# Altium schematic sheet StepStick.SchDoc
size A4
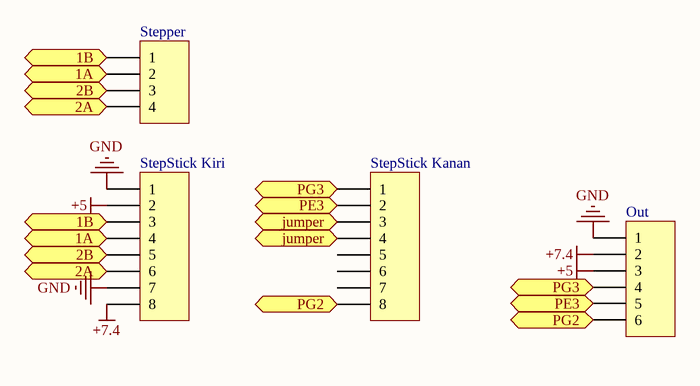
[diagram p0: StepStick.SchDoc]

## Parts
Out  Header 6  [My_1X06]  (value not drawn)
Stepper  (no value)  [My_1X04]
StepStick_Kanan  (no value)  [HDR1X8]
StepStick_Kiri  (no value)  [HDR1X8]

## Ports
1A (in), 1A (out), 1B (in), 1B (out), 2A (in), 2A (out), 2B (in), 2B (out), jumper (in), jumper (out), PE3 (in), PE3 (out), PG2 (in), PG2 (out), PG3 (in), PG3 (out)

## Nets
+5: Out.3 StepStick_Kiri.2
+7.4: Out.2 StepStick_Kiri.8
GND: Out.1 StepStick_Kiri.1 StepStick_Kiri.7
1A: Stepper.2 StepStick_Kiri.4 ; port 1A
1B: Stepper.1 StepStick_Kiri.3 ; port 1B
2A: Stepper.4 StepStick_Kiri.6 ; port 2A
2B: Stepper.3 StepStick_Kiri.5 ; port 2B
jumper: StepStick_Kanan.3 StepStick_Kanan.4 ; port jumper
PE3: Out.5 StepStick_Kanan.2 ; port PE3
PG2: Out.6 StepStick_Kanan.8 ; port PG2
PG3: Out.4 StepStick_Kanan.1 ; port PG3

Not connected (* = marked no-connect by the designer): StepStick_Kanan 5 6 7

## Library data of the parts
Out = Header 6: Header, 6-Pin; LatestRevisionDate: 17-Jul-2002; LatestRevisionNote: Re-released for DXP Platform.; Publisher: Altium Limited
Stepper = Header 4: Header, 4-Pin; LatestRevisionDate: 17-Jul-2002; LatestRevisionNote: Re-released for DXP Platform.; Publisher: Altium Limited
StepStick_Kanan StepStick_Kiri = Header 8: Header, 8-Pin; LatestRevisionDate: 17-Jul-2002; LatestRevisionNote: Re-released for DXP Platform.; Publisher: Altium Limited